# Altium schematic sheet Schematic_Top.SchDoc
size A4; SheetNumber: 5; SheetTotal: 14
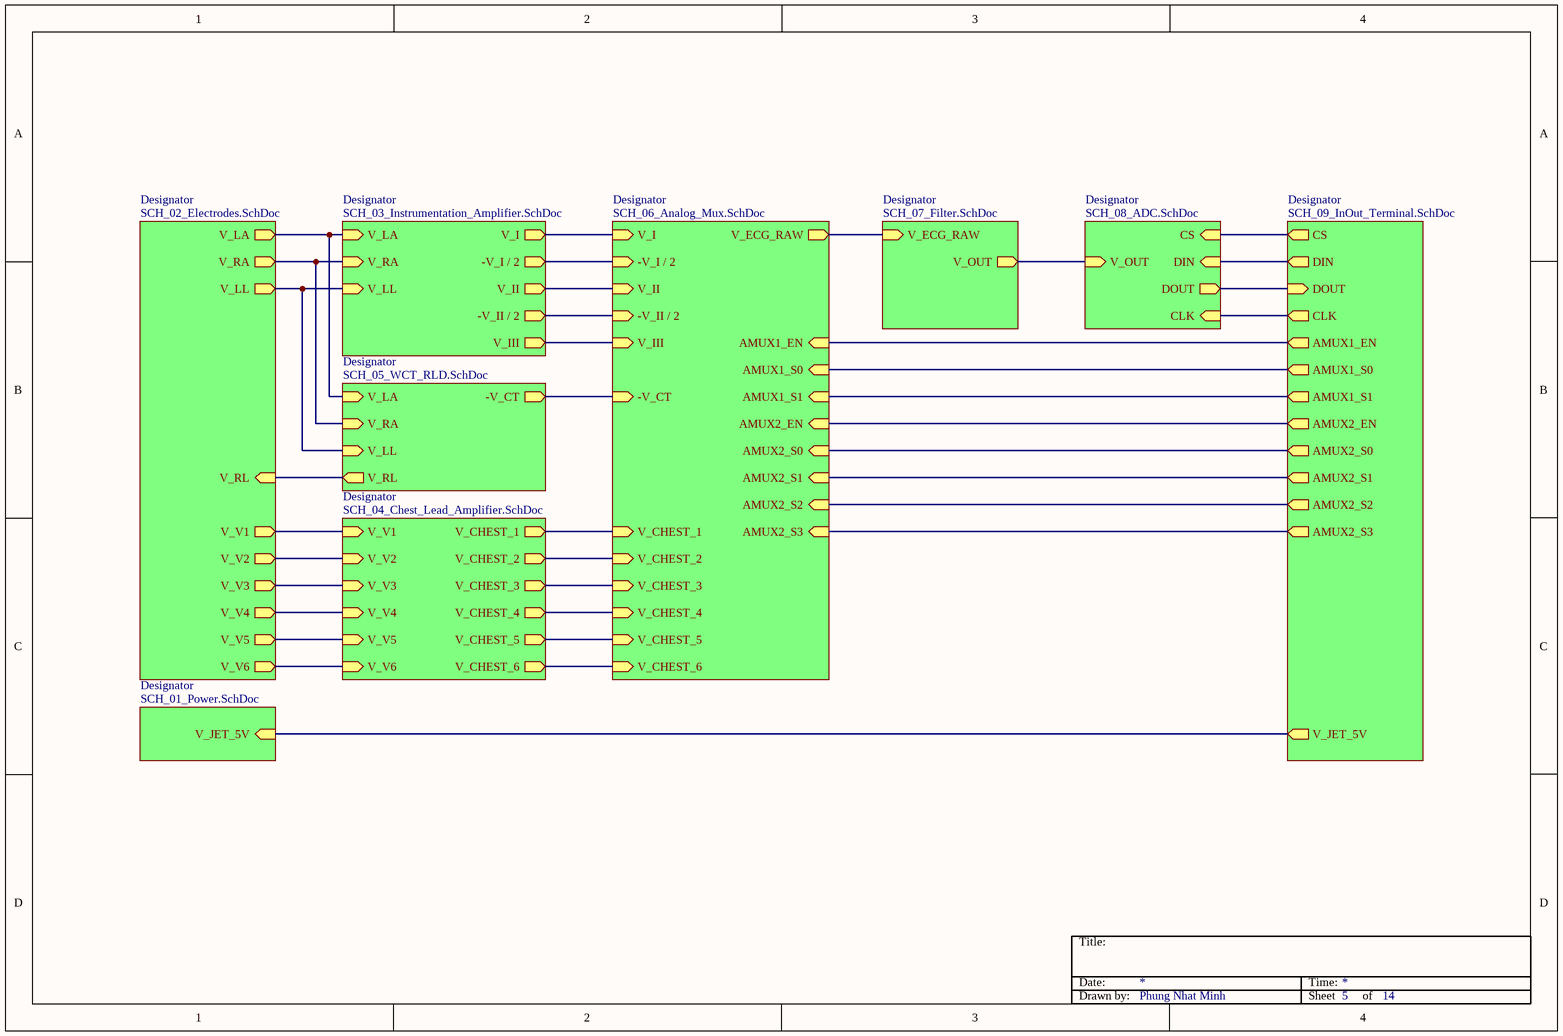
[diagram p0: Schematic_Top.SchDoc]

## Sub-sheets
Designator = SCH_03_Instrumentation_Amplifier.SchDoc: V_I (out), V_LA (in), V_RA (in), V_LL (in), -V_I / 2 (out), V_II (out), -V_II / 2 (out), V_III (out)
Designator = SCH_08_ADC.SchDoc: V_OUT (in), CS (in), DOUT (out), DIN (in), CLK (in)
Designator = SCH_01_Power.SchDoc: V_JET_5V (in)
Designator = SCH_06_Analog_Mux.SchDoc: V_ECG_RAW (out), AMUX1_S0 (in), AMUX1_S1 (in), AMUX2_S0 (in), AMUX2_S1 (in), AMUX2_S2 (in), AMUX2_S3 (in), V_I (in), -V_I / 2 (in), V_II (in), -V_II / 2 (in), V_III (in), -V_CT (in), V_CHEST_1 (in), V_CHEST_2 (in), V_CHEST_3 (in), V_CHEST_4 (in), V_CHEST_5 (in), V_CHEST_6 (in), AMUX2_EN (in), AMUX1_EN (in)
Designator = SCH_09_InOut_Terminal.SchDoc: DIN (out), CS (out), DOUT (in), CLK (out), AMUX1_S0 (out), AMUX1_S1 (out), AMUX2_S0 (out), AMUX2_S1 (out), AMUX2_S2 (out), AMUX2_S3 (out), V_JET_5V (out), AMUX2_EN (out), AMUX1_EN (out)
Designator = SCH_02_Electrodes.SchDoc: V_LA (out), V_RA (out), V_LL (out), V_V1 (out), V_V2 (out), V_V3 (out), V_V4 (out), V_V5 (out), V_V6 (out), V_RL (in)
Designator = SCH_05_WCT_RLD.SchDoc: V_LA (in), V_RA (in), V_LL (in), V_RL (out), -V_CT (out)
Designator = SCH_07_Filter.SchDoc: V_OUT (out), V_ECG_RAW (in)
Designator = SCH_04_Chest_Lead_Amplifier.SchDoc: V_V1 (in), V_V2 (in), V_V3 (in), V_V4 (in), V_V5 (in), V_V6 (in), V_CHEST_1 (out), V_CHEST_2 (out), V_CHEST_3 (out), V_CHEST_4 (out), V_CHEST_5 (out), V_CHEST_6 (out)

## Nets
(unnamed): sheet Designator/V_I, sheet Designator/V_I
(unnamed): sheet Designator/V_LA, sheet Designator/V_LA, sheet Designator/V_LA
(unnamed): sheet Designator/V_RA, sheet Designator/V_RA, sheet Designator/V_RA
(unnamed): sheet Designator/V_LL, sheet Designator/V_LL, sheet Designator/V_LL
(unnamed): sheet Designator/-V_I / 2, sheet Designator/-V_I / 2
(unnamed): sheet Designator/V_II, sheet Designator/V_II
(unnamed): sheet Designator/-V_II / 2, sheet Designator/-V_II / 2
(unnamed): sheet Designator/V_III, sheet Designator/V_III
(unnamed): sheet Designator/V_OUT, sheet Designator/V_OUT
(unnamed): sheet Designator/CS, sheet Designator/CS
(unnamed): sheet Designator/DOUT, sheet Designator/DOUT
(unnamed): sheet Designator/DIN, sheet Designator/DIN
(unnamed): sheet Designator/CLK, sheet Designator/CLK
(unnamed): sheet Designator/V_JET_5V, sheet Designator/V_JET_5V
(unnamed): sheet Designator/V_ECG_RAW, sheet Designator/V_ECG_RAW
(unnamed): sheet Designator/AMUX1_S0, sheet Designator/AMUX1_S0
(unnamed): sheet Designator/AMUX1_S1, sheet Designator/AMUX1_S1
(unnamed): sheet Designator/AMUX2_S0, sheet Designator/AMUX2_S0
(unnamed): sheet Designator/AMUX2_S1, sheet Designator/AMUX2_S1
(unnamed): sheet Designator/AMUX2_S2, sheet Designator/AMUX2_S2
(unnamed): sheet Designator/AMUX2_S3, sheet Designator/AMUX2_S3
(unnamed): sheet Designator/-V_CT, sheet Designator/-V_CT
(unnamed): sheet Designator/V_CHEST_1, sheet Designator/V_CHEST_1
(unnamed): sheet Designator/V_CHEST_2, sheet Designator/V_CHEST_2
(unnamed): sheet Designator/V_CHEST_3, sheet Designator/V_CHEST_3
(unnamed): sheet Designator/V_CHEST_4, sheet Designator/V_CHEST_4
(unnamed): sheet Designator/V_CHEST_5, sheet Designator/V_CHEST_5
(unnamed): sheet Designator/V_CHEST_6, sheet Designator/V_CHEST_6
(unnamed): sheet Designator/AMUX2_EN, sheet Designator/AMUX2_EN
(unnamed): sheet Designator/AMUX1_EN, sheet Designator/AMUX1_EN
(unnamed): sheet Designator/V_V1, sheet Designator/V_V1
(unnamed): sheet Designator/V_V2, sheet Designator/V_V2
(unnamed): sheet Designator/V_V3, sheet Designator/V_V3
(unnamed): sheet Designator/V_V4, sheet Designator/V_V4
(unnamed): sheet Designator/V_V5, sheet Designator/V_V5
(unnamed): sheet Designator/V_V6, sheet Designator/V_V6
(unnamed): sheet Designator/V_RL, sheet Designator/V_RL

## Notes on the sheet
- Title:
- Date:
- Time:
- Drawn by:
- Phung Nhat Minh
- Sheet
- of